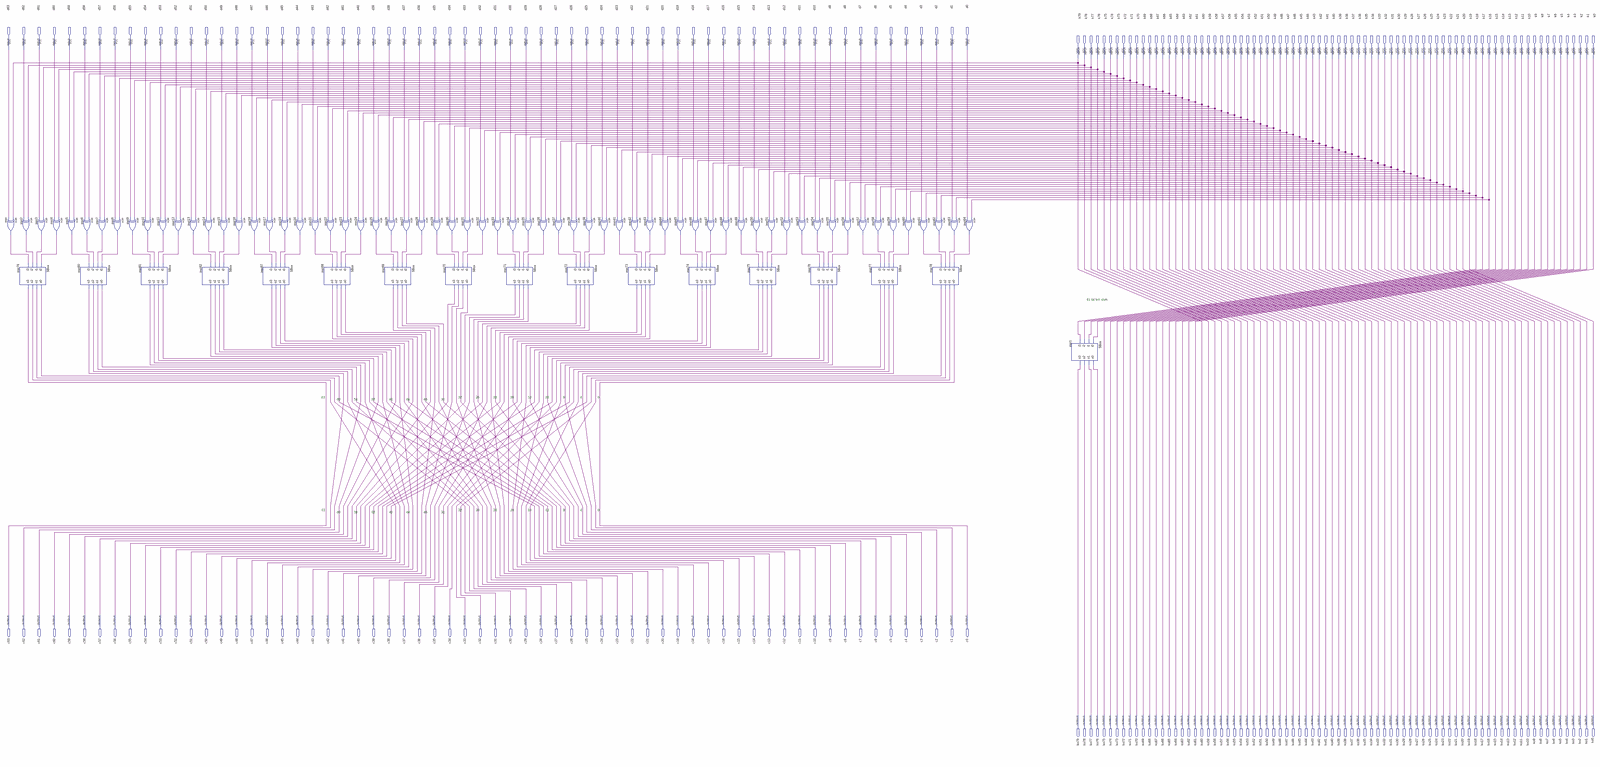
[diagram p0: schematic sheet, whole]
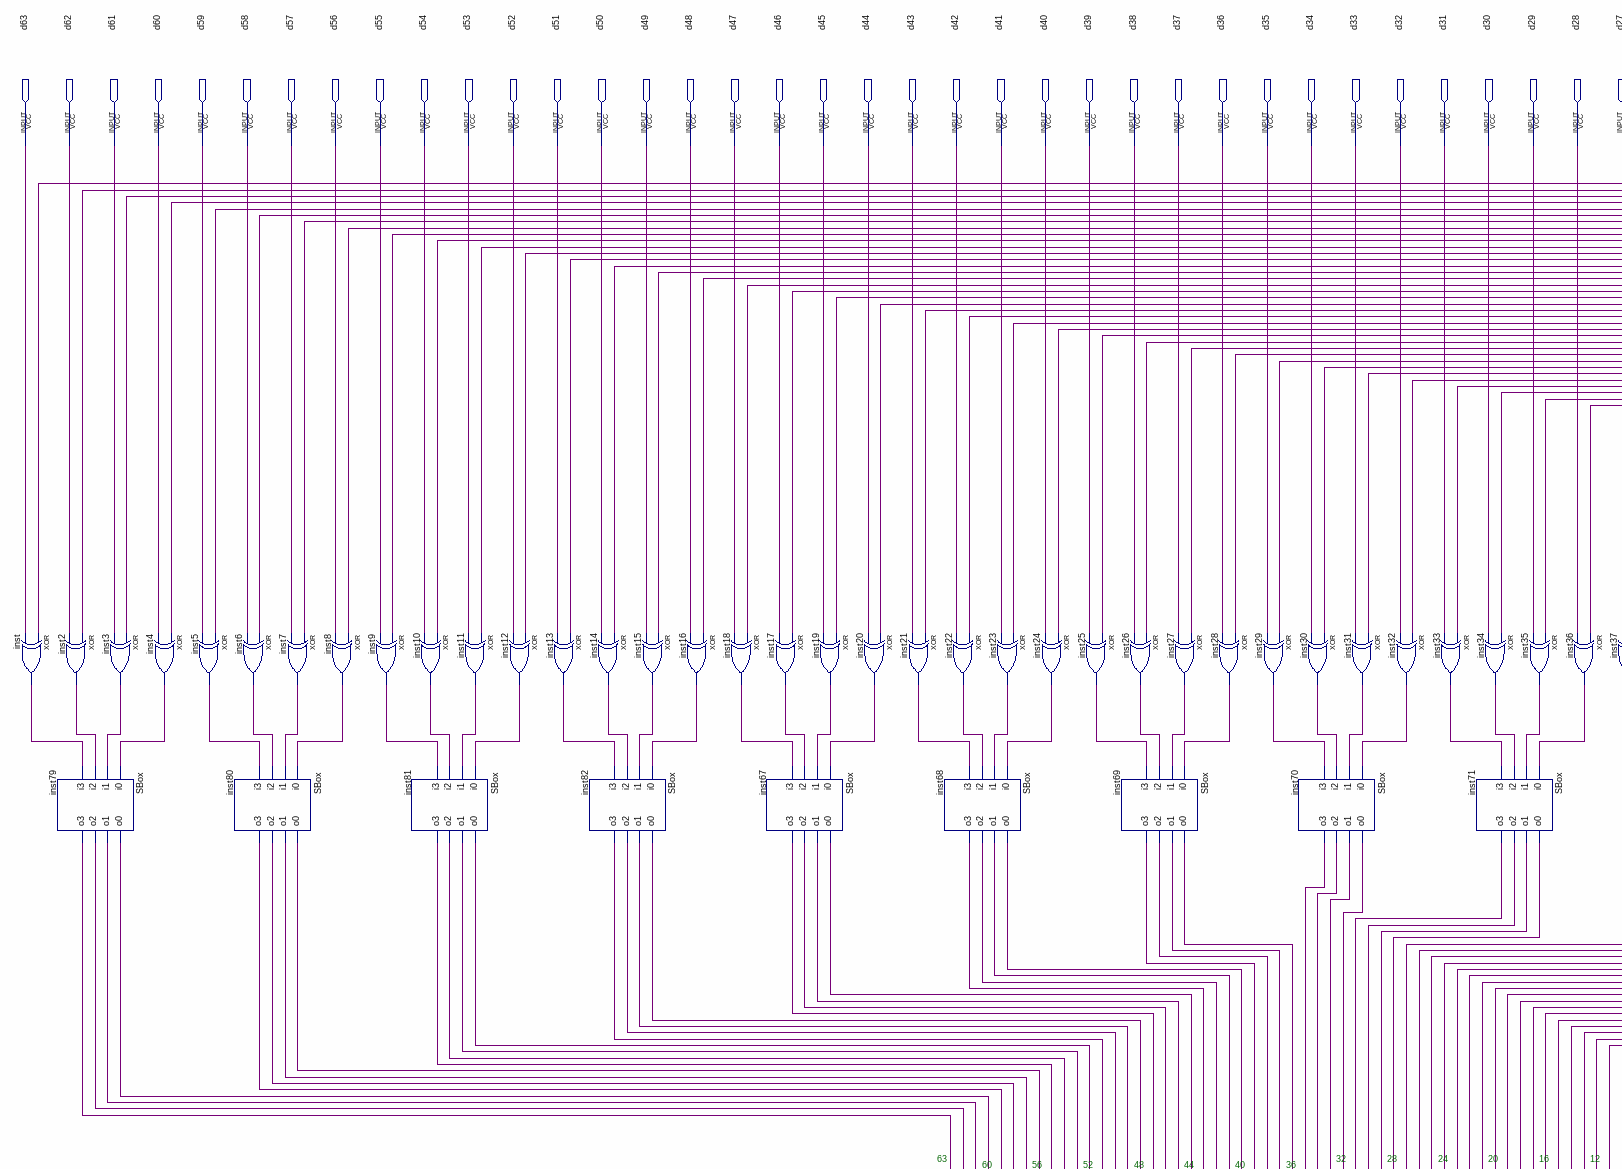
[diagram p1: schematic sheet, upper left part]
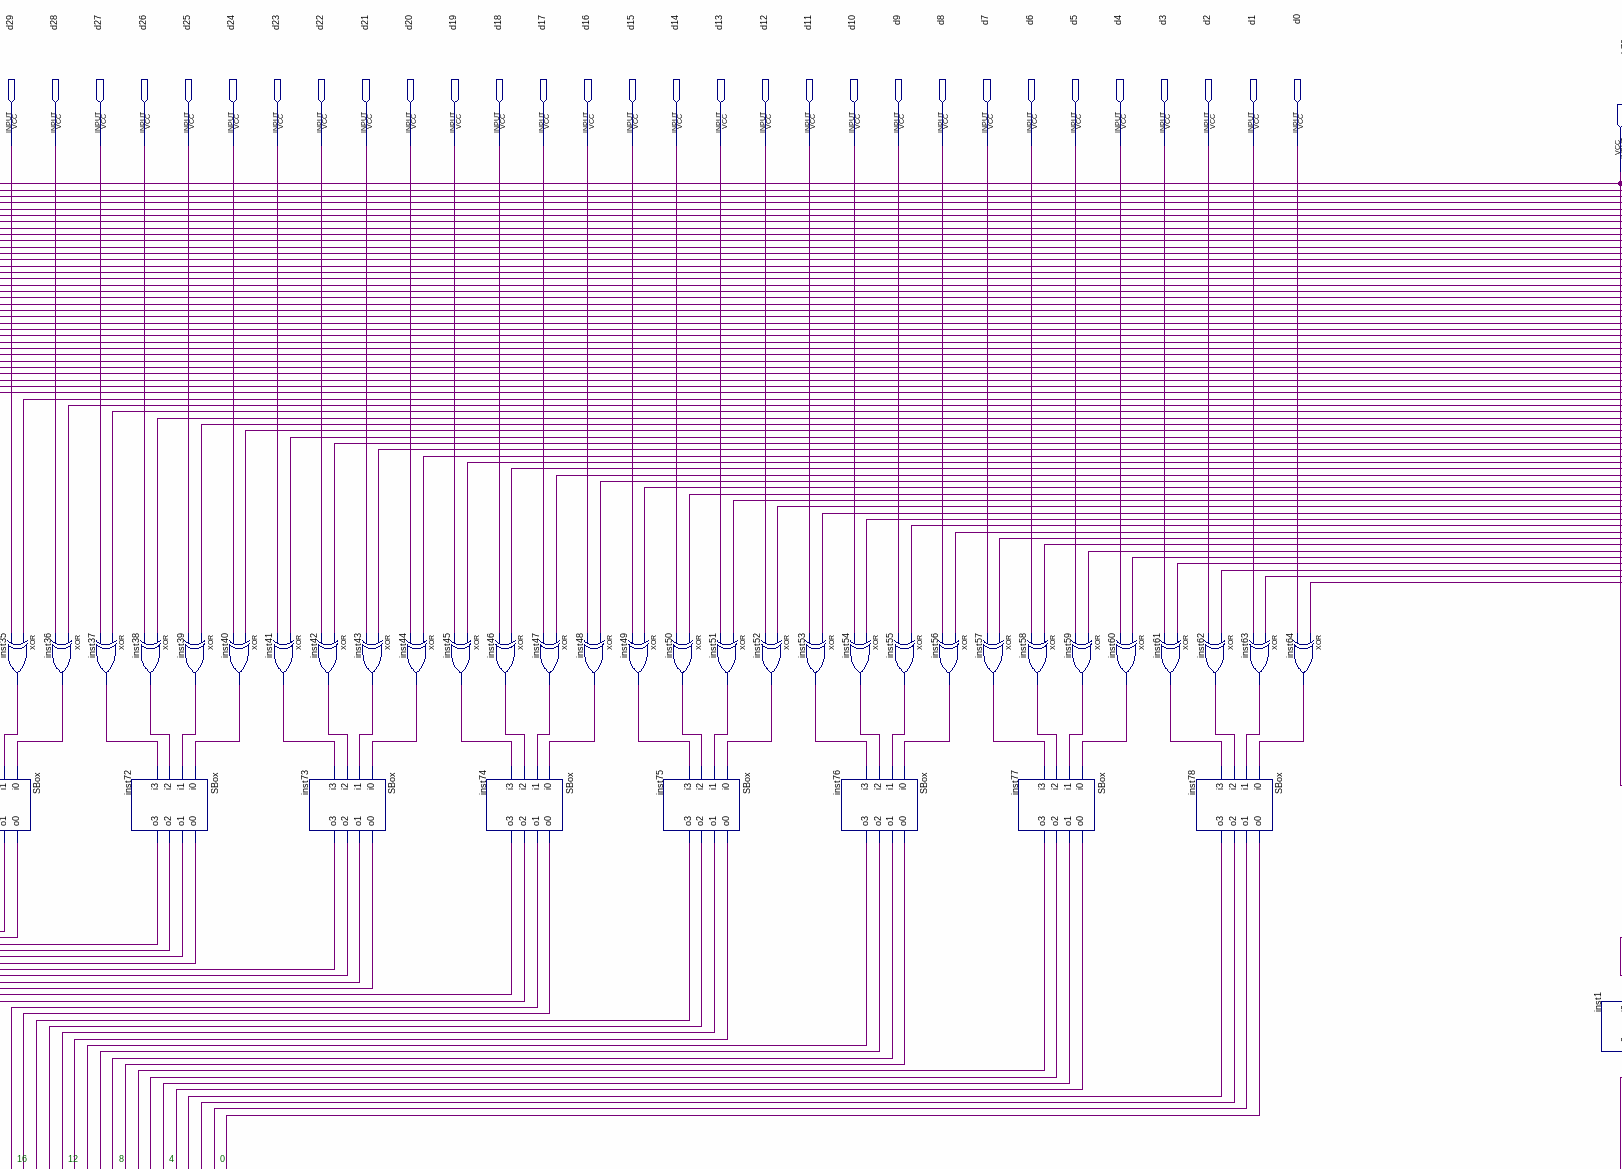
[diagram p2: schematic sheet, upper centre part]
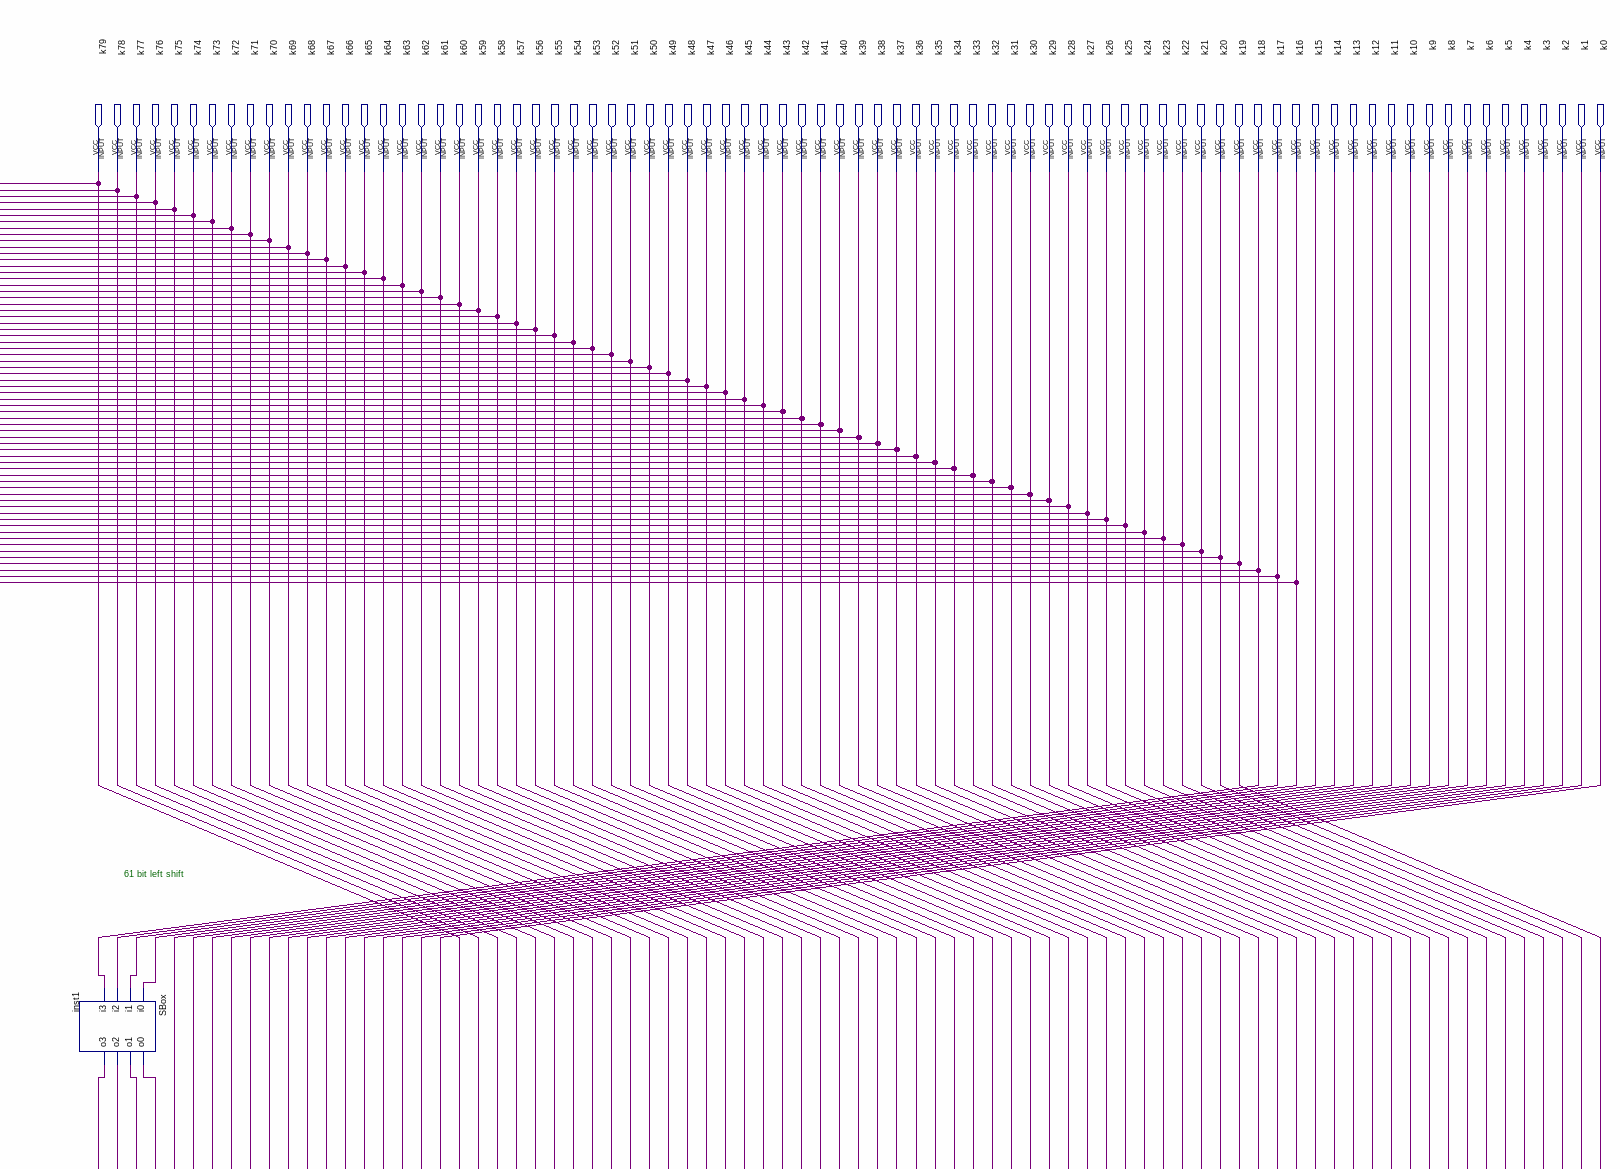
[diagram p3: schematic sheet, upper right part]
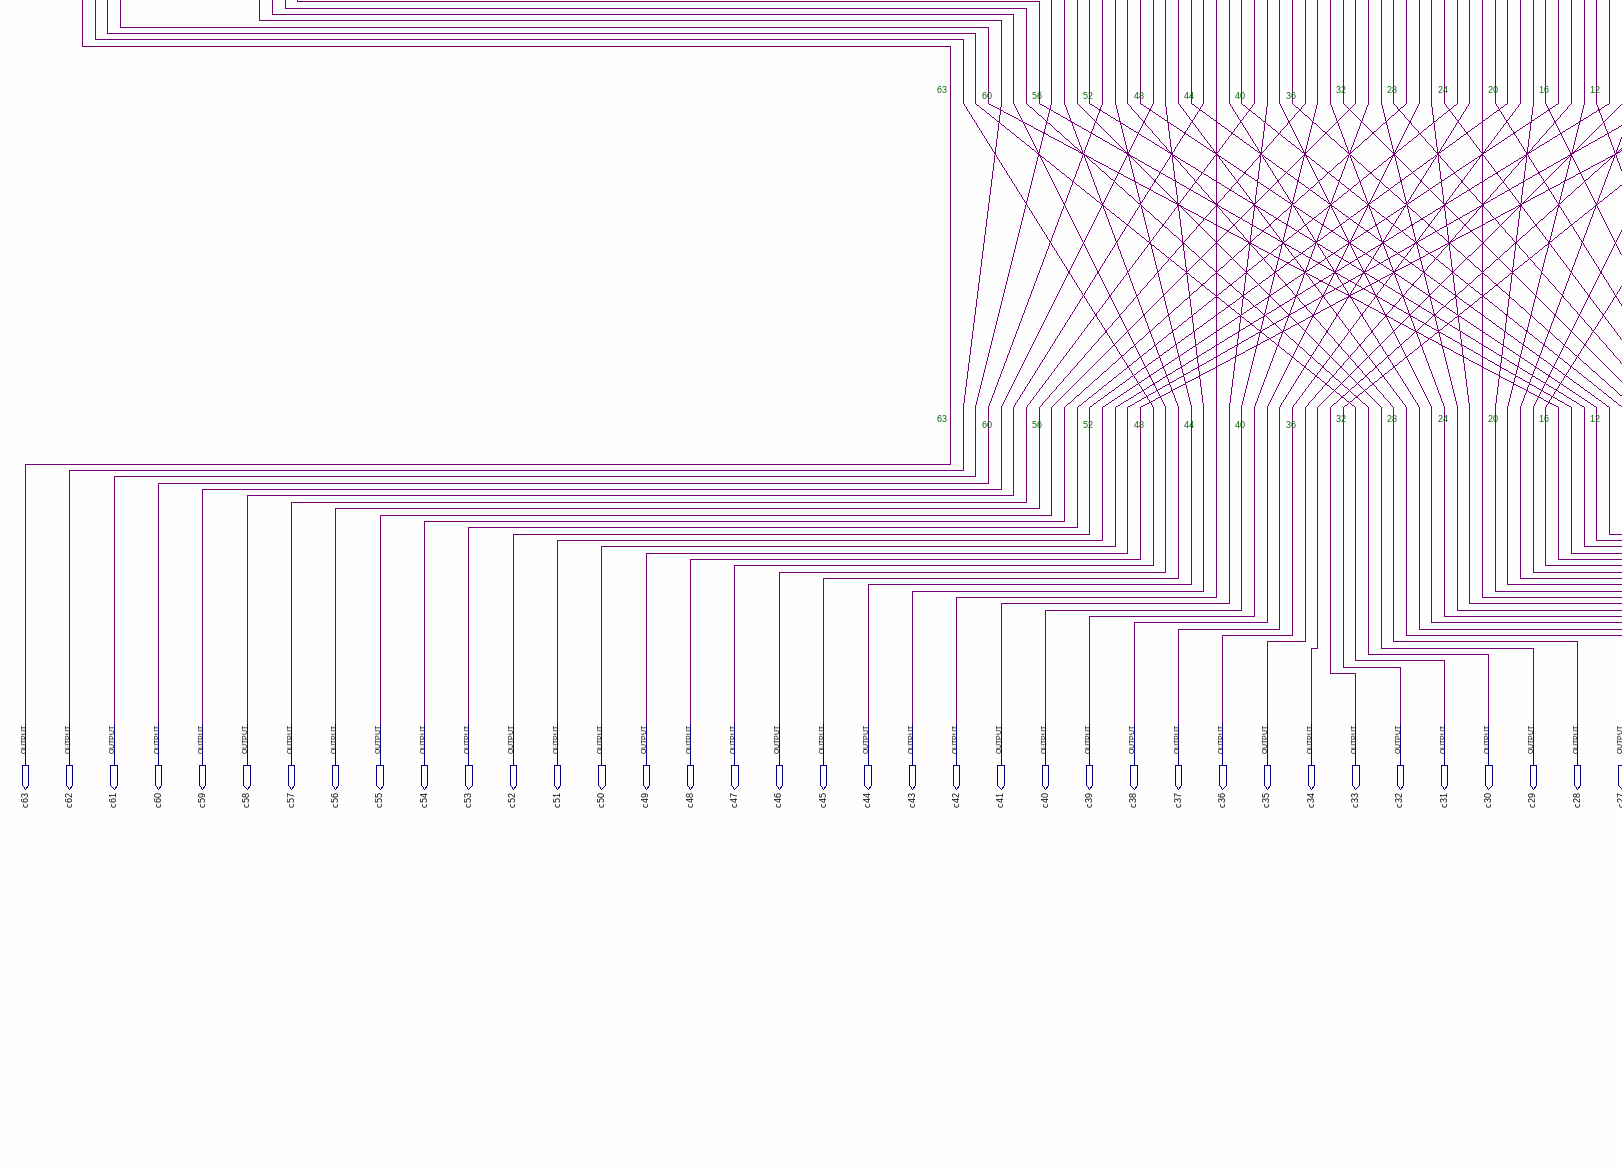
[diagram p4: schematic sheet, lower left part]
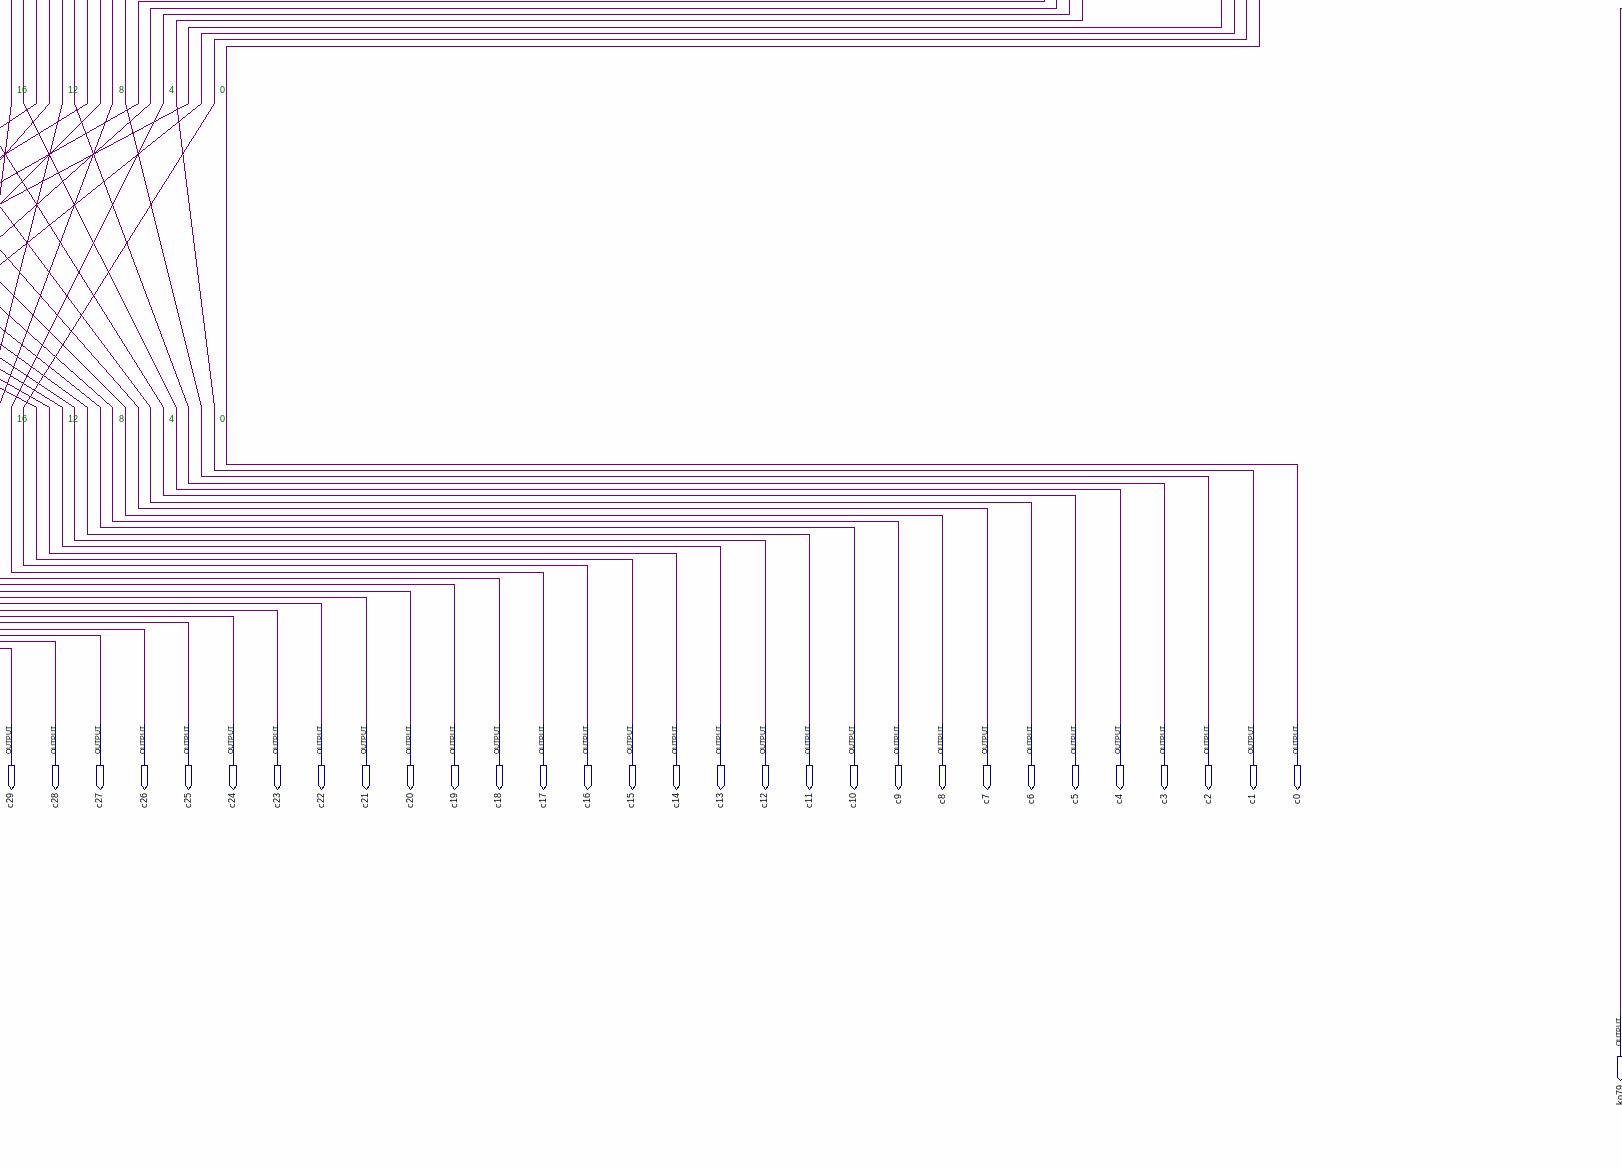
[diagram p5: schematic sheet, lower centre part]
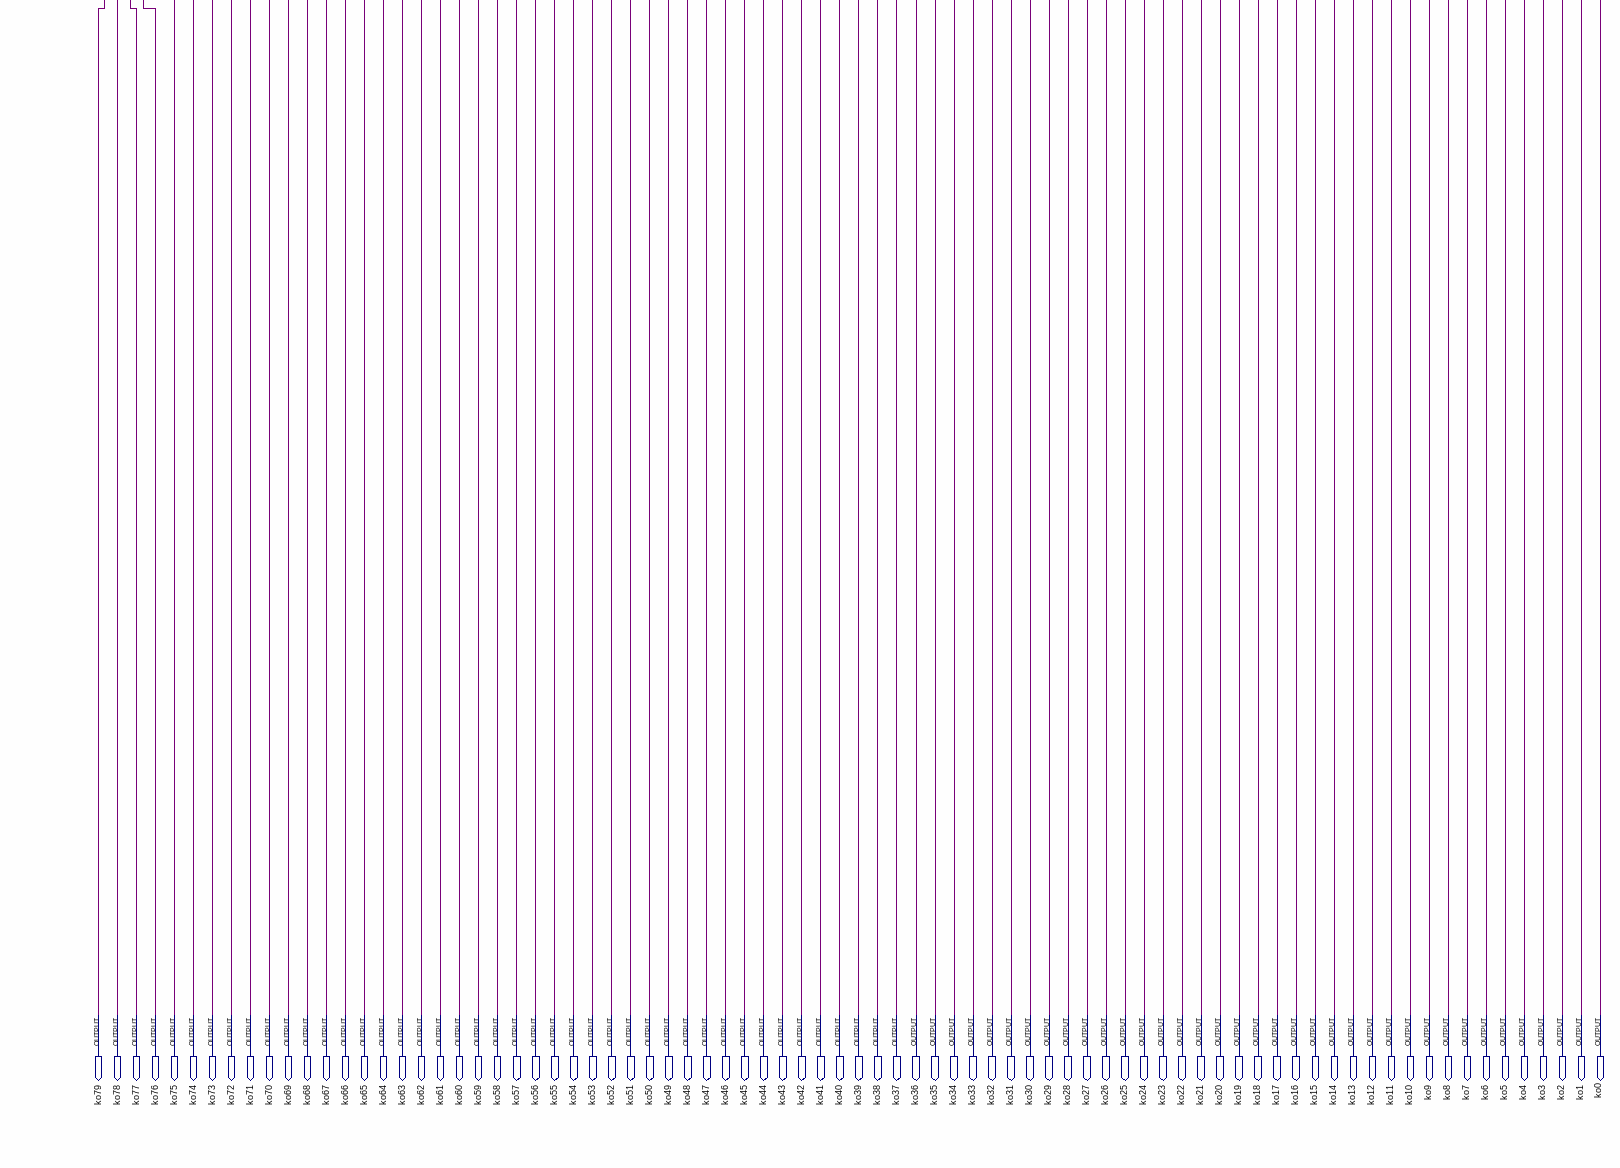
[diagram p6: schematic sheet, lower right part]
// Quartus schematic EROUND.bdf as structural Verilog: 81 symbols, 288 pins
module EROUND (
  input  d63,
  input  d62,
  input  d61,
  input  d60,
  input  d59,
  input  d58,
  input  d57,
  input  d56,
  input  d55,
  input  d54,
  input  d53,
  input  d52,
  input  d51,
  input  d50,
  input  d49,
  input  d48,
  input  d47,
  input  d46,
  input  d45,
  input  d44,
  input  d43,
  input  d42,
  input  d41,
  input  d40,
  input  d39,
  input  d38,
  input  d37,
  input  d36,
  input  d35,
  input  d34,
  input  d33,
  input  d32,
  input  d31,
  input  d30,
  input  d29,
  input  d28,
  input  d27,
  input  d26,
  input  d25,
  input  d24,
  input  d23,
  input  d22,
  input  d21,
  input  d20,
  input  d19,
  input  d18,
  input  d17,
  input  d16,
  input  d15,
  input  d14,
  input  d13,
  input  d12,
  input  d11,
  input  d10,
  input  d9,
  input  d8,
  input  d7,
  input  d6,
  input  d5,
  input  d4,
  input  d3,
  input  d2,
  input  d1,
  input  d0,
  input  k79,
  input  k78,
  input  k77,
  input  k76,
  input  k75,
  input  k74,
  input  k73,
  input  k72,
  input  k71,
  input  k70,
  input  k69,
  input  k68,
  input  k67,
  input  k66,
  input  k65,
  input  k64,
  input  k63,
  input  k62,
  input  k61,
  input  k60,
  input  k59,
  input  k58,
  input  k57,
  input  k56,
  input  k55,
  input  k54,
  input  k53,
  input  k52,
  input  k51,
  input  k50,
  input  k49,
  input  k48,
  input  k47,
  input  k46,
  input  k45,
  input  k44,
  input  k43,
  input  k42,
  input  k41,
  input  k40,
  input  k39,
  input  k38,
  input  k37,
  input  k36,
  input  k35,
  input  k34,
  input  k33,
  input  k32,
  input  k31,
  input  k30,
  input  k29,
  input  k28,
  input  k27,
  input  k26,
  input  k25,
  input  k24,
  input  k23,
  input  k22,
  input  k21,
  input  k20,
  input  k19,
  input  k18,
  input  k17,
  input  k16,
  input  k15,
  input  k14,
  input  k13,
  input  k12,
  input  k11,
  input  k10,
  input  k9,
  input  k8,
  input  k7,
  input  k6,
  input  k5,
  input  k4,
  input  k3,
  input  k2,
  input  k1,
  input  k0,
  output c63,
  output c62,
  output c61,
  output c60,
  output c59,
  output c58,
  output c57,
  output c56,
  output c55,
  output c54,
  output c53,
  output c52,
  output c51,
  output c50,
  output c49,
  output c48,
  output c47,
  output c46,
  output c45,
  output c44,
  output c43,
  output c42,
  output c41,
  output c40,
  output c39,
  output c38,
  output c37,
  output c36,
  output c35,
  output c34,
  output c33,
  output c32,
  output c31,
  output c30,
  output c29,
  output c28,
  output c27,
  output c26,
  output c25,
  output c24,
  output c23,
  output c22,
  output c21,
  output c20,
  output c19,
  output c18,
  output c17,
  output c16,
  output c15,
  output c14,
  output c13,
  output c12,
  output c11,
  output c10,
  output c9,
  output c8,
  output c7,
  output c6,
  output c5,
  output c4,
  output c3,
  output c2,
  output c1,
  output c0,
  output ko79,
  output ko78,
  output ko77,
  output ko76,
  output ko75,
  output ko74,
  output ko73,
  output ko72,
  output ko71,
  output ko70,
  output ko69,
  output ko68,
  output ko67,
  output ko66,
  output ko65,
  output ko64,
  output ko63,
  output ko62,
  output ko61,
  output ko60,
  output ko59,
  output ko58,
  output ko57,
  output ko56,
  output ko55,
  output ko54,
  output ko53,
  output ko52,
  output ko51,
  output ko50,
  output ko49,
  output ko48,
  output ko47,
  output ko46,
  output ko45,
  output ko44,
  output ko43,
  output ko42,
  output ko41,
  output ko40,
  output ko39,
  output ko38,
  output ko37,
  output ko36,
  output ko35,
  output ko34,
  output ko33,
  output ko32,
  output ko31,
  output ko30,
  output ko29,
  output ko28,
  output ko27,
  output ko26,
  output ko25,
  output ko24,
  output ko23,
  output ko22,
  output ko21,
  output ko20,
  output ko19,
  output ko18,
  output ko17,
  output ko16,
  output ko15,
  output ko14,
  output ko13,
  output ko12,
  output ko11,
  output ko10,
  output ko9,
  output ko8,
  output ko7,
  output ko6,
  output ko5,
  output ko4,
  output ko3,
  output ko2,
  output ko1,
  output ko0
);

  wire inst2_out, inst3_out, inst4_out, inst5_out, inst6_out, inst7_out, inst8_out, inst9_out, inst10_out,
       inst11_out, inst12_out, inst13_out, inst14_out, inst15_out, inst16_out, inst17_out, inst18_out,
       inst19_out, inst20_out, inst21_out, inst22_out, inst23_out, inst24_out, inst25_out, inst26_out,
       inst27_out, inst28_out, inst29_out, inst30_out, inst31_out, inst32_out, inst33_out, inst34_out,
       inst35_out, inst36_out, inst37_out, inst38_out, inst39_out, inst40_out, inst41_out, inst42_out,
       inst43_out, inst44_out, inst45_out, inst46_out, inst47_out, inst48_out, inst49_out, inst50_out,
       inst51_out, inst52_out, inst53_out, inst54_out, inst55_out, inst56_out, inst57_out, inst58_out,
       inst59_out, inst60_out, inst61_out, inst62_out, inst63_out, inst64_out, inst_out;

  xor inst (inst_out, k79, d63);
  xor inst2 (inst2_out, k78, d62);
  SBox inst79 (.i0(inst4_out), .i1(inst3_out), .i2(inst2_out), .i3(inst_out), .o2(c47), .o1(c31), .o3(c63), .o0(c15));
  xor inst3 (inst3_out, k77, d61);
  xor inst4 (inst4_out, k76, d60);
  xor inst5 (inst5_out, k75, d59);
  SBox inst80 (.i0(inst8_out), .i1(inst7_out), .i2(inst6_out), .i3(inst5_out), .o2(c46), .o1(c30), .o3(c62), .o0(c14));
  xor inst6 (inst6_out, k74, d58);
  xor inst7 (inst7_out, k73, d57);
  xor inst8 (inst8_out, k72, d56);
  xor inst9 (inst9_out, k71, d55);
  xor inst10 (inst10_out, k70, d54);
  SBox inst81 (
    .i0(inst12_out), .i1(inst11_out), .i2(inst10_out), .i3(inst9_out), .o2(c45), .o1(c29), .o3(c61), .o0(c13));
  xor inst11 (inst11_out, k69, d53);
  xor inst12 (inst12_out, k68, d52);
  xor inst13 (inst13_out, k67, d51);
  SBox inst82 (
    .i0(inst16_out), .i1(inst15_out), .i2(inst14_out), .i3(inst13_out), .o2(c44), .o1(c28), .o3(c60), .o0(c12));
  xor inst14 (inst14_out, k66, d50);
  xor inst15 (inst15_out, k65, d49);
  xor inst16 (inst16_out, k64, d48);
  xor inst18 (inst18_out, k63, d47);
  xor inst17 (inst17_out, k62, d46);
  SBox inst67 (
    .i0(inst20_out), .i1(inst19_out), .i2(inst17_out), .i3(inst18_out), .o2(c43), .o1(c27), .o3(c59), .o0(c11));
  xor inst19 (inst19_out, k61, d45);
  xor inst20 (inst20_out, k60, d44);
  xor inst21 (inst21_out, k59, d43);
  SBox inst68 (
    .i0(inst24_out), .i1(inst23_out), .i2(inst22_out), .i3(inst21_out), .o2(c42), .o1(c26), .o3(c58), .o0(c10));
  xor inst22 (inst22_out, k58, d42);
  xor inst23 (inst23_out, k57, d41);
  xor inst24 (inst24_out, k56, d40);
  xor inst25 (inst25_out, k55, d39);
  xor inst26 (inst26_out, k54, d38);
  SBox inst69 (
    .i0(inst28_out), .i1(inst27_out), .i2(inst26_out), .i3(inst25_out), .o2(c41), .o1(c25), .o3(c57), .o0(c9));
  xor inst27 (inst27_out, k53, d37);
  xor inst28 (inst28_out, k52, d36);
  xor inst29 (inst29_out, k51, d35);
  SBox inst70 (
    .i0(inst32_out), .i1(inst31_out), .i2(inst30_out), .i3(inst29_out), .o2(c40), .o1(c24), .o3(c56), .o0(c8));
  xor inst30 (inst30_out, k50, d34);
  xor inst31 (inst31_out, k49, d33);
  xor inst32 (inst32_out, k48, d32);
  xor inst33 (inst33_out, k47, d31);
  xor inst34 (inst34_out, k46, d30);
  SBox inst71 (
    .i0(inst36_out), .i1(inst35_out), .i2(inst34_out), .i3(inst33_out), .o2(c39), .o1(c23), .o3(c55), .o0(c7));
  xor inst35 (inst35_out, k45, d29);
  xor inst36 (inst36_out, k44, d28);
  xor inst37 (inst37_out, k43, d27);
  SBox inst72 (
    .i0(inst40_out), .i1(inst39_out), .i2(inst38_out), .i3(inst37_out), .o2(c38), .o1(c22), .o3(c54), .o0(c6));
  xor inst38 (inst38_out, k42, d26);
  xor inst39 (inst39_out, k41, d25);
  xor inst40 (inst40_out, k40, d24);
  xor inst41 (inst41_out, k39, d23);
  xor inst42 (inst42_out, k38, d22);
  SBox inst73 (
    .i0(inst44_out), .i1(inst43_out), .i2(inst42_out), .i3(inst41_out), .o2(c37), .o1(c21), .o3(c53), .o0(c5));
  xor inst43 (inst43_out, k37, d21);
  xor inst44 (inst44_out, k36, d20);
  xor inst45 (inst45_out, k35, d19);
  SBox inst74 (
    .i0(inst48_out), .i1(inst47_out), .i2(inst46_out), .i3(inst45_out), .o2(c36), .o1(c20), .o3(c52), .o0(c4));
  xor inst46 (inst46_out, k34, d18);
  xor inst47 (inst47_out, k33, d17);
  xor inst48 (inst48_out, k32, d16);
  xor inst49 (inst49_out, k31, d15);
  xor inst50 (inst50_out, k30, d14);
  SBox inst75 (
    .i0(inst52_out), .i1(inst51_out), .i2(inst50_out), .i3(inst49_out), .o2(c35), .o1(c19), .o3(c51), .o0(c3));
  xor inst51 (inst51_out, k29, d13);
  xor inst52 (inst52_out, k28, d12);
  xor inst53 (inst53_out, k27, d11);
  SBox inst76 (
    .i0(inst56_out), .i1(inst55_out), .i2(inst54_out), .i3(inst53_out), .o2(c34), .o1(c18), .o3(c50), .o0(c2));
  xor inst54 (inst54_out, k26, d10);
  xor inst55 (inst55_out, k25, d9);
  xor inst56 (inst56_out, k24, d8);
  xor inst57 (inst57_out, k23, d7);
  xor inst58 (inst58_out, k22, d6);
  SBox inst77 (
    .i0(inst60_out), .i1(inst59_out), .i2(inst58_out), .i3(inst57_out), .o2(c33), .o1(c17), .o3(c49), .o0(c1));
  xor inst59 (inst59_out, k21, d5);
  xor inst60 (inst60_out, k20, d4);
  xor inst61 (inst61_out, k19, d3);
  SBox inst78 (
    .i0(inst64_out), .i1(inst63_out), .i2(inst62_out), .i3(inst61_out), .o2(c32), .o1(c16), .o3(c48), .o0(c0));
  xor inst62 (inst62_out, k18, d2);
  xor inst63 (inst63_out, k17, d1);
  xor inst64 (inst64_out, k16, d0);
  SBox inst1 (.i0(k15), .i1(k16), .i2(k17), .i3(k18), .o2(ko78), .o1(ko77), .o3(ko79), .o0(ko76));

  assign ko0 = k19;
  assign ko1 = k20;
  assign ko2 = k21;
  assign ko3 = k22;
  assign ko4 = k23;
  assign ko5 = k24;
  assign ko6 = k25;
  assign ko7 = k26;
  assign ko8 = k27;
  assign ko9 = k28;
  assign ko10 = k29;
  assign ko11 = k30;
  assign ko12 = k31;
  assign ko13 = k32;
  assign ko14 = k33;
  assign ko15 = k34;
  assign ko16 = k35;
  assign ko17 = k36;
  assign ko18 = k37;
  assign ko19 = k38;
  assign ko20 = k39;
  assign ko21 = k40;
  assign ko22 = k41;
  assign ko23 = k42;
  assign ko24 = k43;
  assign ko25 = k44;
  assign ko26 = k45;
  assign ko27 = k46;
  assign ko28 = k47;
  assign ko29 = k48;
  assign ko30 = k49;
  assign ko31 = k50;
  assign ko32 = k51;
  assign ko33 = k52;
  assign ko34 = k53;
  assign ko35 = k54;
  assign ko36 = k55;
  assign ko37 = k56;
  assign ko38 = k57;
  assign ko39 = k58;
  assign ko40 = k59;
  assign ko41 = k60;
  assign ko42 = k61;
  assign ko43 = k62;
  assign ko44 = k63;
  assign ko45 = k64;
  assign ko46 = k65;
  assign ko47 = k66;
  assign ko48 = k67;
  assign ko49 = k68;
  assign ko50 = k69;
  assign ko51 = k70;
  assign ko52 = k71;
  assign ko53 = k72;
  assign ko54 = k73;
  assign ko55 = k74;
  assign ko56 = k75;
  assign ko57 = k76;
  assign ko58 = k77;
  assign ko59 = k78;
  assign ko60 = k79;
  assign ko61 = k0;
  assign ko62 = k1;
  assign ko63 = k2;
  assign ko64 = k3;
  assign ko65 = k4;
  assign ko66 = k5;
  assign ko67 = k6;
  assign ko68 = k7;
  assign ko69 = k8;
  assign ko70 = k9;
  assign ko71 = k10;
  assign ko72 = k11;
  assign ko73 = k12;
  assign ko74 = k13;
  assign ko75 = k14;

  // Notes on the sheet:
  //   61 bit left shift
  //   63
  //   32
  //   28
  //   24
  //   20
  //   16
  //   12
  //   8
  //   4
  //   0
  //   60
  //   56
  //   52
  //   48
  //   44
  //   40
  //   36
  //   63
  //   32
  //   28
  //   24
  //   20
  //   16
  //   12
  //   8
  //   4
  //   0
  //   60
  //   56
  //   52
  //   48
  //   44
  //   40
  //   36
endmodule
